# Altium schematic sheet MCU.SchDoc
size 420 x 297 mm
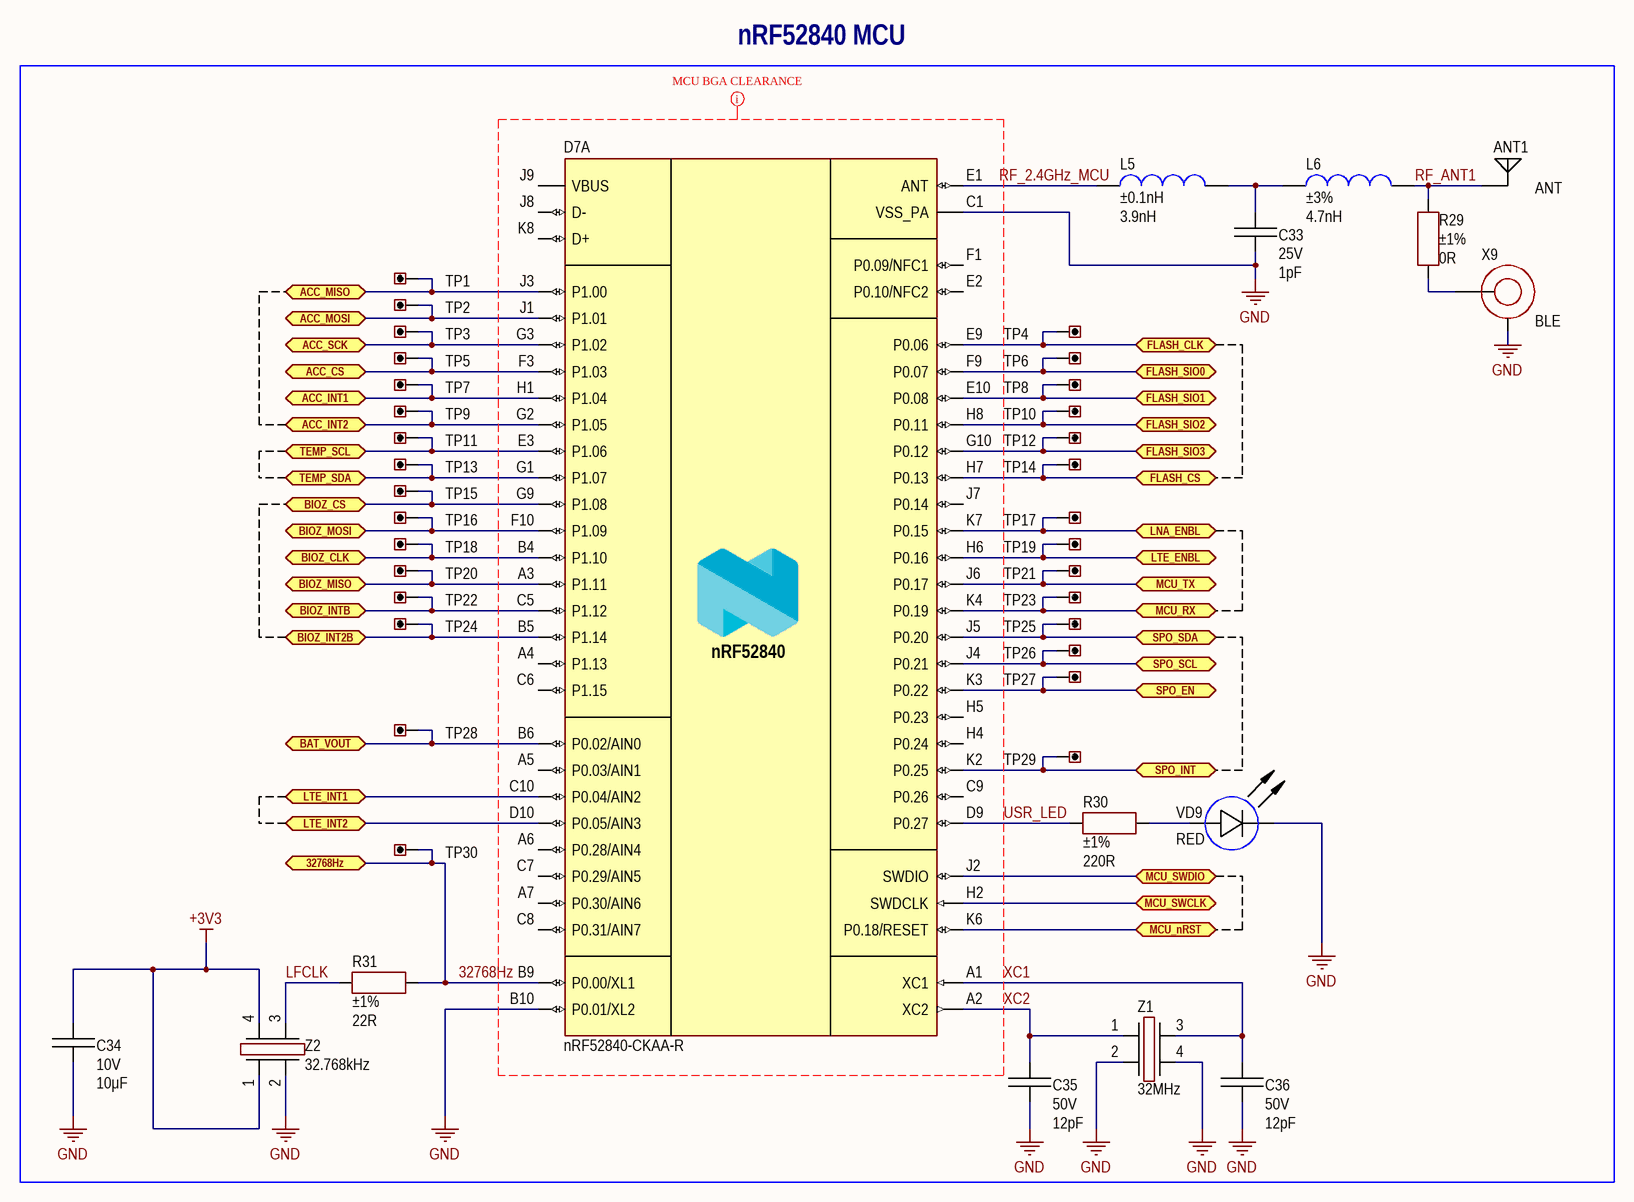
[diagram p0: MCU.SchDoc]

## Parts
ANT1  CommentText: ANT  [ANT: ANT2012LL00R2400A]
C33  value 1pF  Voltage: 25V  [CAP: 0201]
C34  value 10μF  Voltage: 10V  [CAP: 0805]
C35  value 12pF  Voltage: 50V  [CAP: 0805]
C36  value 12pF  Voltage: 50V  [CAP: 0805]
D7  PartNumber: nRF52840-CKAA-R  [MCU: nRF52840_WLCP93]  (part A of 2)
L5  value 3.9nH  Tolerance: ±0.1nH  [IND: 0201]
L6  value 4.7nH  Tolerance: ±3%  [IND: 0201]
R29  value 0R  Tolerance: ±1%  [RES: 0201]
R30  value 220R  Tolerance: ±1%  [RES: 0805]
R31  value 22R  Tolerance: ±1%  [RES: 0805]
TP1  (no value)  [CON: 5000 (Keystone)]
TP2  (no value)  [CON: 5000 (Keystone)]
TP3  (no value)  [CON: 5000 (Keystone)]
TP4  (no value)  [CON: 5000 (Keystone)]
TP5  (no value)  [CON: 5000 (Keystone)]
TP6  (no value)  [CON: 5000 (Keystone)]
TP7  (no value)  [CON: 5000 (Keystone)]
TP8  (no value)  [CON: 5000 (Keystone)]
TP9  (no value)  [CON: 5000 (Keystone)]
TP10  (no value)  [CON: 5000 (Keystone)]
TP11  (no value)  [CON: 5000 (Keystone)]
TP12  (no value)  [CON: 5000 (Keystone)]
TP13  (no value)  [CON: 5000 (Keystone)]
TP14  (no value)  [CON: 5000 (Keystone)]
TP15  (no value)  [CON: 5000 (Keystone)]
TP16  (no value)  [CON: 5000 (Keystone)]
TP17  (no value)  [CON: 5000 (Keystone)]
TP18  (no value)  [CON: 5000 (Keystone)]
TP19  (no value)  [CON: 5000 (Keystone)]
TP20  (no value)  [CON: 5000 (Keystone)]
TP21  (no value)  [CON: 5000 (Keystone)]
TP22  (no value)  [CON: 5000 (Keystone)]
TP23  (no value)  [CON: 5000 (Keystone)]
TP24  (no value)  [CON: 5000 (Keystone)]
TP25  (no value)  [CON: 5000 (Keystone)]
TP26  (no value)  [CON: 5000 (Keystone)]
TP27  (no value)  [CON: 5000 (Keystone)]
TP28  (no value)  [CON: 5000 (Keystone)]
TP29  (no value)  [CON: 5000 (Keystone)]
TP30  (no value)  [CON: 5000 (Keystone)]
VD9  Color: RED  [LED: 0805R]
X9  CommentText: BLE  [CON: u.Fl]
Z1  Frequency: 32MHz  [OSC: 2016]
Z2  Frequency: 32.768kHz  [OSC: 5032G]

## Blocks framed on the sheet
nRF52840 MCU: ANT1 C33-C36 D7 L5 L6 R29-R31 TP1-TP30 VD9 X9 Z1 Z2

## Ports
32768Hz (bidir), ACC_CS (bidir), ACC_INT1 (bidir), ACC_INT2 (bidir), ACC_MISO (bidir), ACC_MOSI (bidir), ACC_SCK (bidir), BAT_VOUT (bidir), BIOZ_CLK (bidir), BIOZ_CS (bidir), BIOZ_INT2B (bidir), BIOZ_INTB (bidir), BIOZ_MISO (bidir), BIOZ_MOSI (bidir), FLASH_CLK (bidir), FLASH_CS (bidir), FLASH_SIO0 (bidir), FLASH_SIO1 (bidir), FLASH_SIO2 (bidir), FLASH_SIO3 (bidir), LNA_ENBL (bidir), LTE_ENBL (bidir), LTE_INT1 (bidir), LTE_INT2 (bidir), MCU_nRST (bidir), MCU_RX (bidir), MCU_SWCLK (bidir), MCU_SWDIO (bidir), MCU_TX (bidir), SPO_EN (bidir), SPO_INT (bidir), SPO_SCL (bidir), SPO_SDA (bidir), TEMP_SCL (bidir), TEMP_SDA (bidir)

## Nets
+3V3: C34.2 Z2.1 Z2.4
GND: C33.1 C34.1 C35.1 C36.1 D7.B10(P0.01/XL2) D7.C1(VSS_PA) VD9.2(C) X9.2 Z1.2 Z1.4 Z2.2
32768Hz: D7.B9(P0.00/XL1) R31.1 TP30.1 ; port 32768Hz
ACC_CS: D7.F3(P1.03) TP5.1 ; port ACC_CS
ACC_INT1: D7.H1(P1.04) TP7.1 ; port ACC_INT1
ACC_INT2: D7.G2(P1.05) TP9.1 ; port ACC_INT2
ACC_MISO: D7.J3(P1.00) TP1.1 ; port ACC_MISO
ACC_MOSI: D7.J1(P1.01) TP2.1 ; port ACC_MOSI
ACC_SCK: D7.G3(P1.02) TP3.1 ; port ACC_SCK
BAT_VOUT: D7.B6(P0.02/AIN0) TP28.1 ; port BAT_VOUT
BIOZ_CLK: D7.B4(P1.10) TP18.1 ; port BIOZ_CLK
BIOZ_CS: D7.G9(P1.08) TP15.1 ; port BIOZ_CS
BIOZ_INT2B: D7.B5(P1.14) TP24.1 ; port BIOZ_INT2B
BIOZ_INTB: D7.C5(P1.12) TP22.1 ; port BIOZ_INTB
BIOZ_MISO: D7.A3(P1.11) TP20.1 ; port BIOZ_MISO
BIOZ_MOSI: D7.F10(P1.09) TP16.1 ; port BIOZ_MOSI
FLASH_CLK: D7.E9(P0.06) TP4.1 ; port FLASH_CLK
FLASH_CS: D7.H7(P0.13) TP14.1 ; port FLASH_CS
FLASH_SIO0: D7.F9(P0.07) TP6.1 ; port FLASH_SIO0
FLASH_SIO1: D7.E10(P0.08) TP8.1 ; port FLASH_SIO1
FLASH_SIO2: D7.H8(P0.11) TP10.1 ; port FLASH_SIO2
FLASH_SIO3: D7.G10(P0.12) TP12.1 ; port FLASH_SIO3
LFCLK: R31.2 Z2.3
LNA_ENBL: D7.K7(P0.15) TP17.1 ; port LNA_ENBL
LTE_ENBL: D7.H6(P0.16) TP19.1 ; port LTE_ENBL
LTE_INT1: D7.C10(P0.04/AIN2) ; port LTE_INT1
LTE_INT2: D7.D10(P0.05/AIN3) ; port LTE_INT2
MCU_nRST: D7.K6(P0.18/RESET) ; port MCU_nRST
MCU_RX: D7.K4(P0.19) TP23.1 ; port MCU_RX
MCU_SWCLK: D7.H2(SWDCLK) ; port MCU_SWCLK
MCU_SWDIO: D7.J2(SWDIO) ; port MCU_SWDIO
MCU_TX: D7.J6(P0.17) TP21.1 ; port MCU_TX
RF_2.4GHz_MCU: D7.E1(ANT) L5.2
RF_ANT1: ANT1.1 L6.1 R29.2
SPO_EN: D7.K3(P0.22) TP27.1 ; port SPO_EN
SPO_INT: D7.K2(P0.25) TP29.1 ; port SPO_INT
SPO_SCL: D7.J4(P0.21) TP26.1 ; port SPO_SCL
SPO_SDA: D7.J5(P0.20) TP25.1 ; port SPO_SDA
TEMP_SCL: D7.E3(P1.06) TP11.1 ; port TEMP_SCL
TEMP_SDA: D7.G1(P1.07) TP13.1 ; port TEMP_SDA
USR_LED: D7.D9(P0.27) R30.2
XC1: C36.2 D7.A1(XC1) Z1.3
XC2: C35.2 D7.A2(XC2) Z1.1
NetC33_2: C33.2 L5.1 L6.2
NetR29_1: R29.1 X9.1
NetR30_1: R30.1 VD9.1(A)

Not connected (* = marked no-connect by the designer): D7 A4(P1.13) A5(P0.03/AIN1) A6(P0.28/AIN4) A7(P0.30/AIN6) C6(P1.15) C7(P0.29/AIN5) C8(P0.31/AIN7) C9(P0.26) E2(P0.10/NFC2) F1(P0.09/NFC1) H4(P0.24) H5(P0.23) J7(P0.14) J8(D-) J9(VBUS) K8(D+)

## Layout directives
net class MCU_BGA_CLEARANCE: RF_2.4GHz_MCU, USR_LED, XC1, XC2

## Notes on the sheet
- Author
- Manufacturer
- Date
- Page
- Total pages
- Size page
- A3
- Materials

## Library data of the parts
ANT1 = ANT2012LL00R2400A: 2.45GHz Bluetooth, ISM, Wi-Fi, Zigbee Chip RF Antenna 2.4GHz ~ 2.5GHz 3.77dBi Solder Surface Mount; Manufacturer: Yageo; ValueManufacturerPartNumber: Ceramic antenna, 2x1.25mm; HelpURL: https://www.digikey.com/en/products/detail/yageo/ANT2012LL00R2400A/9360375; Type: Ceramic antenna; PartNumber: ANT2012LL00R2400A; Package: 2x1.25mm
C33 = Ceramic_0201: 1 pF ±0.05pF 25V Ceramic Capacitor C0G, NP0 0201 (0603 Metric); Manufacturer: Murata Electronics; PartNumber: GJM0335C1E1R0WB01D; ValueManufacturerPartNumber: Ceramic capacitor, 1pF, NP0, ±0.05pF, 25V, 0201, -55...+125°C; Package: 0201; HelpURL: https://www.digikey.com/en/products/detail/murata-electronics/GJM0335C1E1R0WB01D/2592505; Temperature: -55...+125°C; TypeCapacitor: Ceramic capacitor; Tolerance: ±0.05pF; TypeDielectric: NP0
C34 = Ceramic_0805: 10 µF ±10% 10V Ceramic Capacitor X7R 0805 (2012 Metric); Manufacturer: Yageo; PartNumber: CC0805KFX7R6BB106; ValueManufacturerPartNumber: Ceramic capacitor, 10μF, X7R, ±10%, 10V, 0805, -55...+125°C; Package: 0805; HelpURL: https://www.digikey.com/en/products/detail/yageo/CC0805KFX7R6BB106/11611326; Temperature: -55...+125°C; TypeCapacitor: Ceramic capacitor; Tolerance: ±10%; TypeDielectric: X7R
C35 C36 = Ceramic_0805: 12 pF ±1% 50V Ceramic Capacitor C0G, NP0 0805 (2012 Metric); Manufacturer: Yageo; PartNumber: CC0805FRNPO9BN120; ValueManufacturerPartNumber: Ceramic capacitor, 12pF, NP0, ±10%, 50V, 0805, -55...+125°C; Tolerance: ±10%; Package: 0805; HelpURL: https://www.digikey.com/en/products/detail/yageo/CC0805FRNPO9BN120/5883925; Temperature: -55...+125°C; TypeCapacitor: Ceramic capacitor; TypeDielectric: NP0
D7 = nRF52840: MCU; Manufacturer: Nordic Semiconductor; CoreSize: 32bit; Speed: 64 MHz; MemoryROM: 1 MB; CoreProcessor: Cortex-M4; MemoryRAM: 256 kB; HelpURL: https://www.mouser.com/ProductDetail/Nordic-Semiconductor/nRF52840-CKAA-R?qs=PqoDHHvF64%2FDLCQsJ11t5w%3D%3D; ComponentType: IC microcontroller; Package: 93-WLCSP; ValueManufacturerPartNumber: =ComponentType+', '+CoreSize+', '+CoreProcessor+', '+Speed+', '+MemoryROM+', '+MemoryRAM+', '+Supply+', '+Temperature+', '+Package
L5 = Inductor_0201: 3.9 nH Unshielded Thick Film Inductor 400 mA 300mOhm Max 0201 (0603 Metric); Manufacturer: Murata Electronics; PartNumber: LQP03TN3N9B02D; ValueManufacturerPartNumber: Fixed inductor, 3.9nH, ±0.1nH, 0201, 400mA, -55...+125°C; TypeInductor: Fixed inductor; MaxCurrent: 400mA; Package: 0201; HelpURL: https://www.digikey.com/en/products/detail/murata-electronics/LQP03TN3N9B02D/2391748; Temperature: -55...+125°C
L6 = Inductor_0201: 4.7 nH Unshielded Thick Film Inductor 350 mA 400mOhm Max 0201 (0603 Metric); Manufacturer: Murata Electronics; PartNumber: LQP03TN4N7H02D; ValueManufacturerPartNumber: Fixed inductor, 4.7nH, ±3%, 0201, 350mA, -55...+125°C; TypeInductor: Fixed inductor; MaxCurrent: 350mA; Package: 0201; HelpURL: https://www.digikey.com/en/products/detail/murata-electronics/LQP03TN4N7H02D/4358101; Temperature: -55...+125°C
R29 = Resistor_0201: 0 Ohms Jumper 0.05W, 1/20W Chip Resistor 0201 (0603 Metric) Moisture Resistant Thick Film; Manufacturer: Yageo; PartNumber: RC0201FR-070RL; ValueManufacturerPartNumber: Resistor film, 0R, ±1%, 0201, 0.05W, -55...+125°C; TypeResistor: Resistor film; Package: 0201; HelpURL: https://www.digikey.com/en/products/detail/yageo/RC0201FR-070RL/1948858; Temperature: -55...+125°C; Power: 0.05W
R30 = Resistor_0805: 22 Ohms ±1% 0.125W, 1/8W Chip Resistor 0805 (2012 Metric) Moisture Resistant Thick Film; Manufacturer: Yageo; PartNumber: RC0805JR-07220RL; ValueManufacturerPartNumber: Resistor film, 220R, ±1%, 0805, 0.125W, -55...+125°C; TypeResistor: Resistor film; Package: 0805; HelpURL: https://www.digikey.com/en/products/detail/yageo/RC0805JR-07220RL/728283; Temperature: -55...+125°C; Power: 0.125W
R31 = Resistor_0805: 22 Ohms ±1% 0.125W, 1/8W Chip Resistor 0805 (2012 Metric) Moisture Resistant Thick Film; Manufacturer: Yageo; PartNumber: RC0805FR-0722RL; ValueManufacturerPartNumber: Resistor film, 22R, ±1%, 0805, 0.125W, -55...+125°C; TypeResistor: Resistor film; Package: 0805; HelpURL: https://www.digikey.com/en/products/detail/yageo/RC0805FR-0722RL/727735; Temperature: -55...+125°C; Power: 0.125W
TP1-TP30 = Connector_Test_Point: Red PC Test Point, Miniature Phosphor Bronze Silver Plating 0.040" (1.02mm) Hole Diameter Mounting Type; Manufacturer: Keystone; ValueManufacturerPartNumber: Test point, Keystone, 5000; PartNumber: 5000; HelpURL: https://www.digikey.com/en/products/detail/keystone-electronics/5000/255326; TypeConnector: Test point
VD9 = LED_single: Red 625nm LED Indication - Discrete 1.8V 0805 (2012 Metric); Manufacturer: Kingbright; ValueManufacturerPartNumber: LED, RED, 30mA, 1.8V, 0805, -55...+150°C; PartNumber: APT2012LSECK/J3-PRV; Current: 30mA; Package: 0805; HelpURL: https://www.digikey.com/en/products/detail/kingbright/APT2012LSECK-J3-PRV/5177436; Temperature: -55...+150°C; TypeDiode: LED; VoltageDrop: 1.8V; ColorParameter: RED
X9 = Connector_uFL: U.FL (UMCC) Connector Receptacle, Male Pin 50Ohm Surface Mount Solder; Manufacturer: Hirose Electric; ValueManufacturerPartNumber: Connector u.FL, 50 Ohm, 6GHz; PartNumber: U.FL-R-SMT(01); TypeConnector: Connector u.FL; Frequency: 6GHz; HelpURL: https://www.digikey.com/product-detail/en/hirose-electric-co-ltd/U.FL-R-SMT-01/H9161-ND/513010; Impedance: 50 Ohm
Z1 = Crystal_2016: 32 MHz ±10ppm Crystal 8pF 60 Ohms 4-SMD, No Lead; Manufacturer: EPSON; PartNumber: FA-128 32.0000MF10Z-AJ3; ValueManufacturerPartNumber: Crystal, 32MHz, 8pF, ±50ppm, case 2016, -30...+85°C; Tolerance: ±50ppm; Package: case 2016; HelpURL: https://www.digikey.com/en/products/detail/epson/FA-128-32-0000MF10Z-AJ3/5259651; Temperature: -30...+85°C; TypeOscilator: Crystal; LoadCapacitance: 8pF
Z2 = Oscilator_5032: 32.768 kHz XO (Standard) LVCMOS Oscillator 1.8V Enable/Disable 4-SMD, No Lead; Manufacturer: Abracon LLC; PartNumber: KD3270037; ValueManufacturerPartNumber: Oscilator, 32.768kHz, HCMOS, ±50ppm, case 5032, -20...+70°C; LoadCapacitance: HCMOS; Tolerance: ±50ppm; Package: case 5032; HelpURL: https://www.digikey.com/en/products/detail/diodes-incorporated/KD3270037/2833169; Temperature: -20...+70°C; TypeOscilator: Oscilator